# EAGLE design ATMEGA2560 Board_V2 (EAGLE 9.6.2)
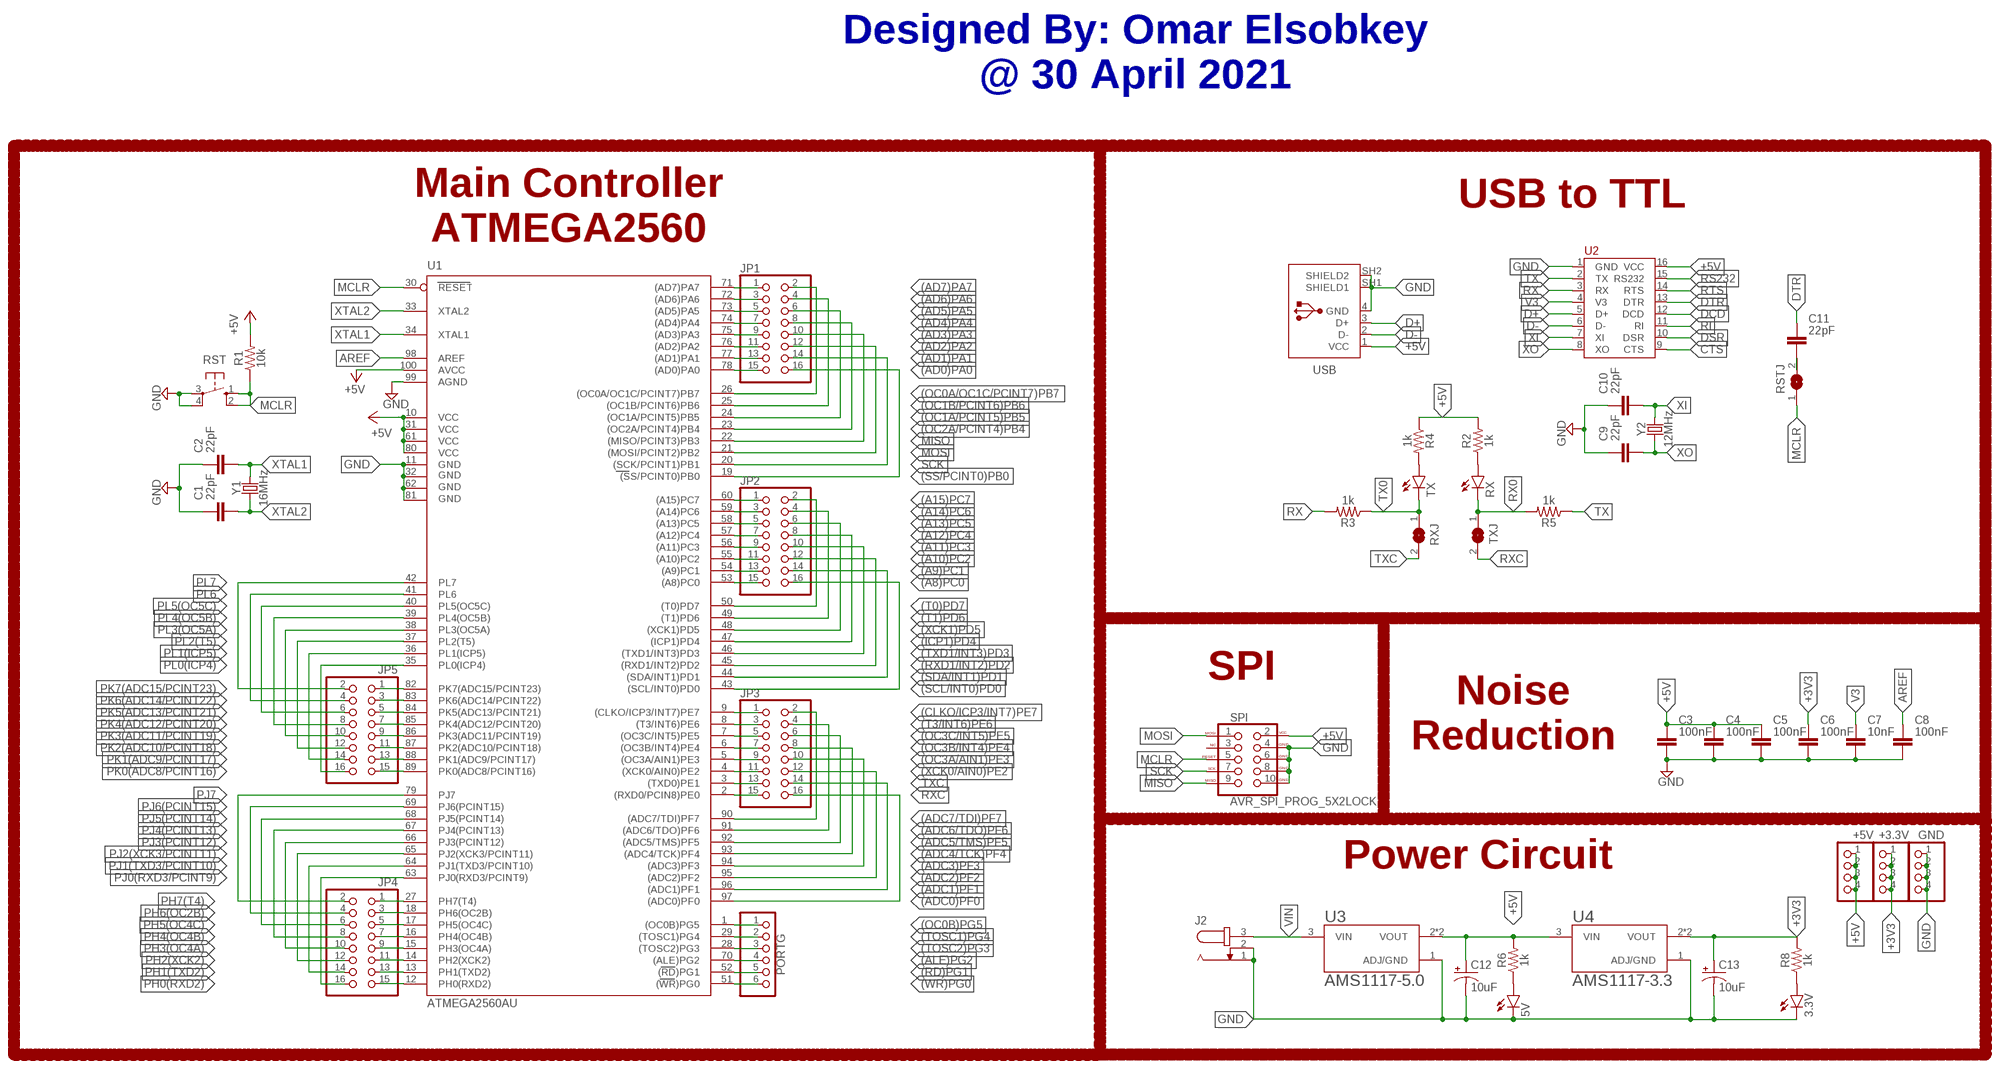
[diagram p0: schematic, sheet 1]

## Parts
3.3V  LEDCHIP-LED0805  [CHIP-LED0805]
5V  LEDCHIP-LED0805  [CHIP-LED0805]
+3.3V  PINHD-1X4  [1X04]
+5V  PINHD-1X4  [1X04]
C1  22pF  C_CHIP-0805(2012-METRIC)  [CAPC2012X110]
C2  22pF  C_CHIP-0805(2012-METRIC)  [CAPC2012X110]
C3  100nF  C_CHIP-0805(2012-METRIC)  [CAPC2012X110]
C4  100nF  C_CHIP-0805(2012-METRIC)  [CAPC2012X110]
C5  100nF  C_CHIP-0805(2012-METRIC)  [CAPC2012X110]
C6  100nF  C_CHIP-0805(2012-METRIC)  [CAPC2012X110]
C7  10nF  C_CHIP-0805(2012-METRIC)  [CAPC2012X110]
C8  100nF  C_CHIP-0805(2012-METRIC)  [CAPC2012X110]
C9  22pF  C_CHIP-0805(2012-METRIC)  [CAPC2012X110]
C10  22pF  C_CHIP-0805(2012-METRIC)  [CAPC2012X110]
C11  22pF  C_CHIP-0805(2012-METRIC)  [CAPC2012X110]
C12  10uF  10UF-POLAR-RADIAL-2.5MM-KIT-25V-20%  [CPOL-RADIAL-2.5MM-5MM-KIT]
C13  10uF  10UF-POLAR-RADIAL-2.5MM-KIT-25V-20%  [CPOL-RADIAL-2.5MM-5MM-KIT]
GND  PINHD-1X4  [1X04]
J2  JACK-PLUG0  [SPC4077]
JP1  PINHD-2X8  [2X08]
JP2  PINHD-2X8  [2X08]
JP3  PINHD-2X8  [2X08]
JP4  PINHD-2X8  [2X08]
JP5  PINHD-2X8  [2X08]
PORTG  PINHD-1X6  [1X06]
R1  10k  RESISTOR1206  [1206]
R2  1k  RESISTOR1206  [1206]
R3  1k  RESISTOR1206  [1206]
R4  1k  RESISTOR1206  [1206]
R5  1k  RESISTOR1206  [1206]
R6  1k  RESISTOR1206  [1206]
R8  1k  RESISTOR1206  [1206]
RST  10-XX  [B3F-10XX]
RSTJ  SJW  [SJW]
RX  LEDCHIP-LED0805  [CHIP-LED0805]
RXJ  SJW  [SJW]
SPI  AVR_SPI_PROG_5X2LOCK  [2X5-SHROUDED_LOCK]
TX  LEDCHIP-LED0805  [CHIP-LED0805]
TXJ  SJW  [SJW]
U1  ATMEGA2560AU  [TQFP100]
U2  CH340G  [SOP-16]
U3  AMS1117-5.0  [AMS1117-5.0]
U4  AMS1117-3.3  AMS1117-5.0  [AMS1117-5.0]
USB  61729-1011  [61729-1011BLF]
Y1  16MHz  CRYSTALPTH-HC49UV  [HC49U]
Y2  12MHz  CRYSTALPTH-HC49UV  [HC49U]

## Nets
(A8)PC0: JP2.15 U1.53((A8)PC0)
(A9)PC1: JP2.13 U1.54((A9)PC1)
(A10)PC2: JP2.11 U1.55((A10)PC2)
(A11)PC3: JP2.9 U1.56((A11)PC3)
(A12)PC4: JP2.7 U1.57((A12)PC4)
(A13)PC5: JP2.5 U1.58((A13)PC5)
(A14)PC6: JP2.3 U1.59((A14)PC6)
(A15)PC7: JP2.1 U1.60((A15)PC7)
(AD0)PA0: JP1.15 U1.78((AD0)PA0)
(AD1)PA1: JP1.13 U1.77((AD1)PA1)
(AD2)PA2: JP1.11 U1.76((AD2)PA2)
(AD3)PA3: JP1.9 U1.75((AD3)PA3)
(AD4)PA4: JP1.7 U1.74((AD4)PA4)
(AD5)PA5: JP1.5 U1.73((AD5)PA5)
(AD6)PA6: JP1.3 U1.72((AD6)PA6)
(AD7)PA7: JP1.1 U1.71((AD7)PA7)
(ADC0)PF0: JP3.16 U1.97((ADC0)PF0)
(ADC1)PF1: JP3.14 U1.96((ADC1)PF1)
(ADC2)PF2: JP3.12 U1.95((ADC2)PF2)
(ADC3)PF3: JP3.10 U1.94((ADC3)PF3)
(ADC4/TCK)PF4: JP3.8 U1.93((ADC4/TCK)PF4)
(ADC5/TMS)PF5: JP3.6 U1.92((ADC5/TMS)PF5)
(ADC6/TDO)PF6: JP3.4 U1.91((ADC6/TDO)PF6)
(ADC7/TDI)PF7: JP3.2 U1.90((ADC7/TDI)PF7)
(ALE)PG2: PORTG.4 U1.70((ALE)PG2)
(CLKO/ICP3/INT7)PE7: JP3.1 U1.9((CLKO/ICP3/INT7)PE7)
(ICP1)PD4: JP2.8 U1.47((ICP1)PD4)
(OC0A/OC1C/PCINT7)PB7: JP1.2 U1.26((OC0A/OC1C/PCINT7)PB7)
(OC0B)PG5: PORTG.1 U1.1((OC0B)PG5)
(OC1A/PCINT5)PB5: JP1.6 U1.24((OC1A/PCINT5)PB5)
(OC1B/PCINT6)PB6: JP1.4 U1.25((OC1B/PCINT6)PB6)
(OC2A/PCINT4)PB4: JP1.8 U1.23((OC2A/PCINT4)PB4)
(OC3A/AIN1)PE3: JP3.9 U1.5((OC3A/AIN1)PE3)
(OC3B/INT4)PE4: JP3.7 U1.6((OC3B/INT4)PE4)
(OC3C/INT5)PE5: JP3.5 U1.7((OC3C/INT5)PE5)
(RD)PG1: PORTG.5 U1.52((RD)PG1)
(RXD1/INT2)PD2: JP2.12 U1.45((RXD1/INT2)PD2)
(SCL/INT0)PD0: JP2.16 U1.43((SCL/INT0)PD0)
(SDA/INT1)PD1: JP2.14 U1.44((SDA/INT1)PD1)
(SS/PCINT0)PB0: JP1.16 U1.19((SS/PCINT0)PB0)
(T0)PD7: JP2.2 U1.50((T0)PD7)
(T1)PD6: JP2.4 U1.49((T1)PD6)
(T3/INT6)PE6: JP3.3 U1.8((T3/INT6)PE6)
(TOSC1)PG4: PORTG.2 U1.29((TOSC1)PG4)
(TOSC2)PG3: PORTG.3 U1.28((TOSC2)PG3)
(TXD1/INT3)PD3: JP2.10 U1.46((TXD1/INT3)PD3)
(WR)PG0: PORTG.6 U1.51((WR)PG0)
(XCK0/AIN0)PE2: JP3.11 U1.4((XCK0/AIN0)PE2)
(XCK1)PD5: JP2.6 U1.48((XCK1)PD5)
+3V3: +3.3V.1 +3.3V.2 +3.3V.3 +3.3V.4 C6.1 C13.1(+) R8.2 U4.2(VOUT) U4.4(VOUT)
+5V: +5V.1 +5V.2 +5V.3 +5V.4 C3.1 C4.1 C5.1 C12.1(+) R1.2 R2.2 R4.1 R6.2 SPI.2(VCC) U1.10(VCC) U1.31(VCC1) U1.61(VCC2) U1.80(VCC3) U1.100(AVCC) U2.16(VCC) U3.2(VOUT) U3.4(VOUT) U4.3(VIN) USB.1(VCC)
AREF: C8.1 U1.98(AREF)
CTS: U2.9(CTS)
D+: U2.5(D+) USB.3(D+)
D-: U2.6(D-) USB.2(D-)
DCD: U2.12(DCD)
DSR: U2.10(DSR)
DTR: C11.1 U2.13(DTR)
GND: 3.3V.C 5V.C C1.1 C2.1 C3.2 C4.2 C5.2 C6.2 C7.2 C8.2 C9.1 C10.1 C12.2(-) C13.2(-) GND.1 GND.2 GND.3 GND.4 J2.1 J2.2 RST.3(P) RST.4(P1) SPI.4(GND) SPI.6(GND) SPI.8(GND) SPI.10(GND) U1.11(GND) U1.32(GND1) U1.62(GND2) U1.81(GND3) U1.99(AGND) U2.1(GND) U3.1(ADJ/GND) U4.1(ADJ/GND) USB.4(GND) USB.SH1(SHIELD1) USB.SH2(SHIELD2)
MCLR: R1.1 RST.1(S) RST.2(S1) RSTJ.1 SPI.5(RESET) U1.30(RESET)
MISO: JP1.10 SPI.9(MISO) U1.22((MISO/PCINT3)PB3)
MOSI: JP1.12 SPI.1(MOSI) U1.21((MOSI/PCINT2)PB2)
N$1: R2.1 RX.A
N$2: R4.2 TX.A
N$3: 5V.A R6.1
N$6: 3.3V.A R8.1
N$100: C11.2 RSTJ.2
PH0(RXD2): JP4.15 U1.12(PH0(RXD2))
PH1(TXD2): JP4.13 U1.13(PH1(TXD2))
PH2(XCK2): JP4.11 U1.14(PH2(XCK2))
PH3(OC4A): JP4.9 U1.15(PH3(OC4A))
PH4(OC4B): JP4.7 U1.16(PH4(OC4B))
PH5(OC4C): JP4.5 U1.17(PH5(OC4C))
PH6(OC2B): JP4.3 U1.18(PH6(OC2B))
PH7(T4): JP4.1 U1.27(PH7(T4))
PJ0(RXD3/PCINT9): JP4.16 U1.63(PJ0(RXD3/PCINT9))
PJ1(TXD3/PCINT10): JP4.14 U1.64(PJ1(TXD3/PCINT10))
PJ2(XCK3/PCINT11): JP4.12 U1.65(PJ2(XCK3/PCINT11))
PJ3(PCINT12): JP4.10 U1.66(PJ3(PCINT12))
PJ4(PCINT13): JP4.8 U1.67(PJ4(PCINT13))
PJ5(PCINT14): JP4.6 U1.68(PJ5(PCINT14))
PJ6(PCINT15): JP4.4 U1.69(PJ6(PCINT15))
PJ7: JP4.2 U1.79(PJ7)
PK0(ADC8/PCINT16): JP5.15 U1.89(PK0(ADC8/PCINT16))
PK1(ADC9/PCINT17): JP5.13 U1.88(PK1(ADC9/PCINT17))
PK2(ADC10/PCINT18): JP5.11 U1.87(PK2(ADC10/PCINT18))
PK3(ADC11/PCINT19): JP5.9 U1.86(PK3(ADC11/PCINT19))
PK4(ADC12/PCINT20): JP5.7 U1.85(PK4(ADC12/PCINT20))
PK5(ADC13/PCINT21): JP5.5 U1.84(PK5(ADC13/PCINT21))
PK6(ADC14/PCINT22): JP5.3 U1.83(PK6(ADC14/PCINT22))
PK7(ADC15/PCINT23): JP5.1 U1.82(PK7(ADC15/PCINT23))
PL0(ICP4): JP5.16 U1.35(PL0(ICP4))
PL1(ICP5): JP5.14 U1.36(PL1(ICP5))
PL2(T5): JP5.12 U1.37(PL2(T5))
PL3(OC5A): JP5.10 U1.38(PL3(OC5A))
PL4(OC5B): JP5.8 U1.39(PL4(OC5B))
PL5(OC5C): JP5.6 U1.40(PL5(OC5C))
PL6: JP5.4 U1.41(PL6)
PL7: JP5.2 U1.42(PL7)
RI: U2.11(RI)
RS232: U2.15(RS232)
RTS: U2.14(RTS)
RX: R3.2 U2.3(RX)
RX0: R5.2 RX.C TXJ.1
RXC: JP3.15 TXJ.2 U1.2((RXD0/PCIN8)PE0)
SCK: JP1.14 SPI.7(SCK) U1.20((SCK/PCINT1)PB1)
TX: R5.1 U2.2(TX)
TX0: R3.1 RXJ.1 TX.C
TXC: JP3.13 RXJ.2 U1.3((TXD0)PE1)
V3: C7.1 U2.4(V3)
VIN: J2.3 U3.3(VIN)
XI: C10.2 U2.7(XI) Y2.2
XO: C9.2 U2.8(XO) Y2.1
XTAL1: C2.2 U1.34(XTAL1) Y1.2
XTAL2: C1.2 U1.33(XTAL2) Y1.1
Unconnected: SPI.3(NC)

## Notes on the sheet
- Designed By: Omar Elsobkey
  @ 30 April 2021
- USB to TTL
- Main Controller
  ATMEGA2560
- SPI
- Noise
  Reduction
- Power Circuit

## Library data of the parts
3.3V 5V RX TX = led:LED: LED OSRAM: - CHIPLED LG R971, LG N971, LY N971, LG Q971, LY Q971, LO R971, LY R971 LH N974, LH R974 LS Q976, LO Q976, LY Q976 LO Q996 - Hyper CHIPLED LW Q18S LB Q993, LB Q99A, LB R99A - SideLED LS A670, LO A670, LY A670, LG A670, LP A670 LB A673, LV A673, LT A673, LW A673 LH A674 LY A675 LS A676, LA A676, LO A676, LY A676, LW A676 LS A679, LY A679, LG A679 - Hyper Micro SIDELED® LS Y876, LA Y876, LO Y876, LY Y876 LT Y87S - SmartLED LW L88C, LW L88S LB L89C, LB L89S, LG L890 LS L89K, LO L89K, LY L89K LS L896, LA L896, LO L896, LY L896 - TOPLED LS T670, LO T670, LY T670, LG T670, LP T670 LSG T670, LSP T670, LSY T670, LOP T670, LYG T670 LG T671, LOG T671, LSG T671 LB T673, LV T673, LT T673, LW T673 LH T674 LS T676, LA T676, LO T676, LY T676, LB T676, LH T676, LSB T676, LW T676 LB T67C, LV T67C, LT T67C, LS T67K, LO T67K, LY T67K, LW E67C LS E67B, LA E67B, LO E67B, LY E67B, LB E67C, LV E67C, LT E67C LW T67C LS T679, LY T679, LG T679 LS T770, LO T770, LY T770, LG T770, LP T770 LB T773, LV T773, LT T773, LW T773 LH T774 LS E675, LA E675, LY E675, LS T675 LS T776, LA T776, LO T776, LY T776, LB T776 LHGB T686 LT T68C, LB T68C - Hyper Mini TOPLED® LB M676 - Mini TOPLED Santana® LG M470 LS M47K, LO M47K, LY M47K Source: http://www.osram.convergy.de LUXEON: - LUMILED® LXK2-PW12-R00, LXK2-PW12-S00, LXK2-PW14-U00, LXK2-PW14-V00 LXK2-PM12-R00, LXK2-PM12-S00, LXK2-PM14-U00 LXK2-PE12-Q00, LXK2-PE12-R00, LXK2-PE12-S00, LXK2-PE14-T00, LXK2-PE14-U00 LXK2-PB12-K00, LXK2-PB12-L00, LXK2-PB12-M00, LXK2-PB14-N00, LXK2-PB14-P00, LXK2-PB14-Q00 LXK2-PR12-L00, LXK2-PR12-M00, LXK2-PR14-Q00, LXK2-PR14-R00 LXK2-PD12-Q00, LXK2-PD12-R00, LXK2-PD12-S00 LXK2-PH12-R00, LXK2-PH12-S00 LXK2-PL12-P00, LXK2-PL12-Q00, LXK2-PL12-R00 Source: www.luxeon.com KINGBRIGHT: KA-3528ASYC Source: www.kingbright.com
+3.3V +5V GND = pinhead:PINHD-1X4: PIN HEADER
C1-C11 = Capacitor:C: Capacitor - Generic; CATEGORY: Capacitor
C12 C13 = SparkFun-Capacitors:10UF-POLAR: 10.0µF polarized capacitors A capacitor is a passive two-terminal electrical component used to store electrical energy temporarily in an electric field.
J2 = con-jack:JACK-PLUG: DC POWER JACK Power Jack, DC, Right Angle, Through Hole, Rated 5A at 16VDC, PC Terminals Distributor: Farnell (www.Farnell.de) Drawing: 84N1161.pdf / 84N1162.pdf Manufacturer: SPC Technology (www.spctechnology.com) Type: SPC4077 / SPC 4078; OC_FARNELL: unknown; OC_NEWARK: unknown
JP1-JP5 = pinhead:PINHD-2X8: PIN HEADER
PORTG = pinhead:PINHD-1X6: PIN HEADER
R1-R6 R8 = SparkFun-Resistors:RESISTOR: Generic Resistor Package
RST = switch-omron:10-XX: OMRON SWITCH; MPN: B3F-1000; OC_FARNELL: 176432; OC_NEWARK: 36M3542
RSTJ RXJ TXJ = jumper:SJ: SMD solder JUMPER
SPI = SparkFun-Connectors:AVR_SPI_PROG_5X2: AVR 10-pin ICSP Header This is the standard AVR In Circuit Serial Programming header. Minimal, but includes pin one indicator. Works with standard Olimex programmers. SparkFun Products: 2x5 AVR ICSP Male Header <https://www.sparkfun.com/products/778> - PTH 2x5 Pin Shrouded Header <https://www.sparkfun.com/products/8506> - PTH2; PROD_ID: CONN-08671; SF_ID: PRT-08506
U1 = SparkFun-IC-Microcontroller:ATMEGA2560: Atmel 100-pin 8-bit uC 64/128/256 Kbytes FLASH 4 Kbytes EEPROM 8 Kbytes SRAM 86 General Purpose I/O pins 12-channels16-bit PWM 4 x Serial USARTs 16-channels 10-bit A/D SparkFun Products None.; PROD_ID: IC-10040
U2 = CH340G:CH340G
U3 U4 = AMS1117-5.0:AMS1117-5.0: Sot223/Pkg 1-Amp 5-Volt Low Drop Out Voltage Regulatator; AVAILABILITY: Unavailable; DESCRIPTION: Sot223/Pkg 1-Amp 5-Volt Low Drop Out Voltage Regulatator; MF: Advanced Monolithic Systems; MP: AMS1117-5.0; PACKAGE: None; PRICE: None
USB = Connector_USB:61729-1011: USB(2.0) Type-B, RCPT, 4POS, THT-R/A Datasheet <https://www.amphenol-icc.com/media/wysiwyg/files/drawing/61729.pdf>; CATEGORY: Connector; CONTACTS: 4; CURRENT_RATING: 1A; DESCRIPTION: CONN RCPT USB2.0 TYPEB 4POS R/A; GENDER: Receptacle; MANUFACTURER: Amphenol ICC (FCI); MOUNT_TYPE: R/A; MPN: 61729-1011BLF; OPERATING_TEMP: -55°C to 85°C; PART_STATUS: Active; ROHS_COMPLIANT: RoHS Compliant; SERIES: 61729; SUB-CATEGORY: USB; TYPE: USB-B
Y1 Y2 = SparkFun-Clocks:CRYSTAL: Crystals (Generic) These are passive quartz crystals, which can be used as a clock source for a microcontroller. Crystal's are two-terminal devices. They require external "load" capacitors to generate an oscillating signal.

## Board
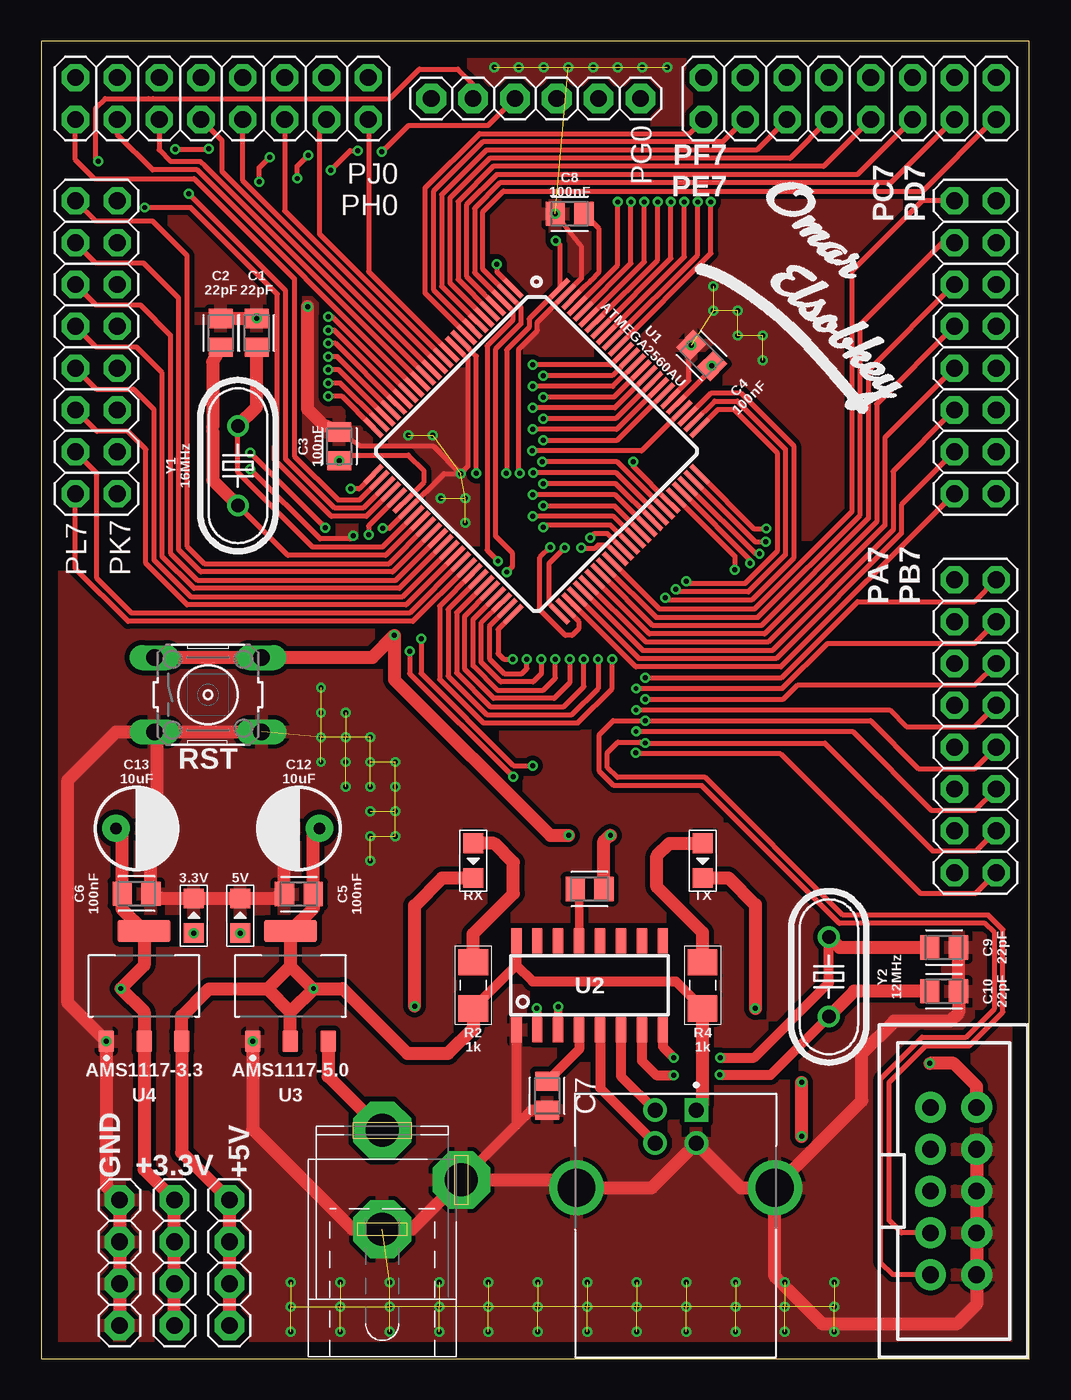
[diagram p1: board, top side]
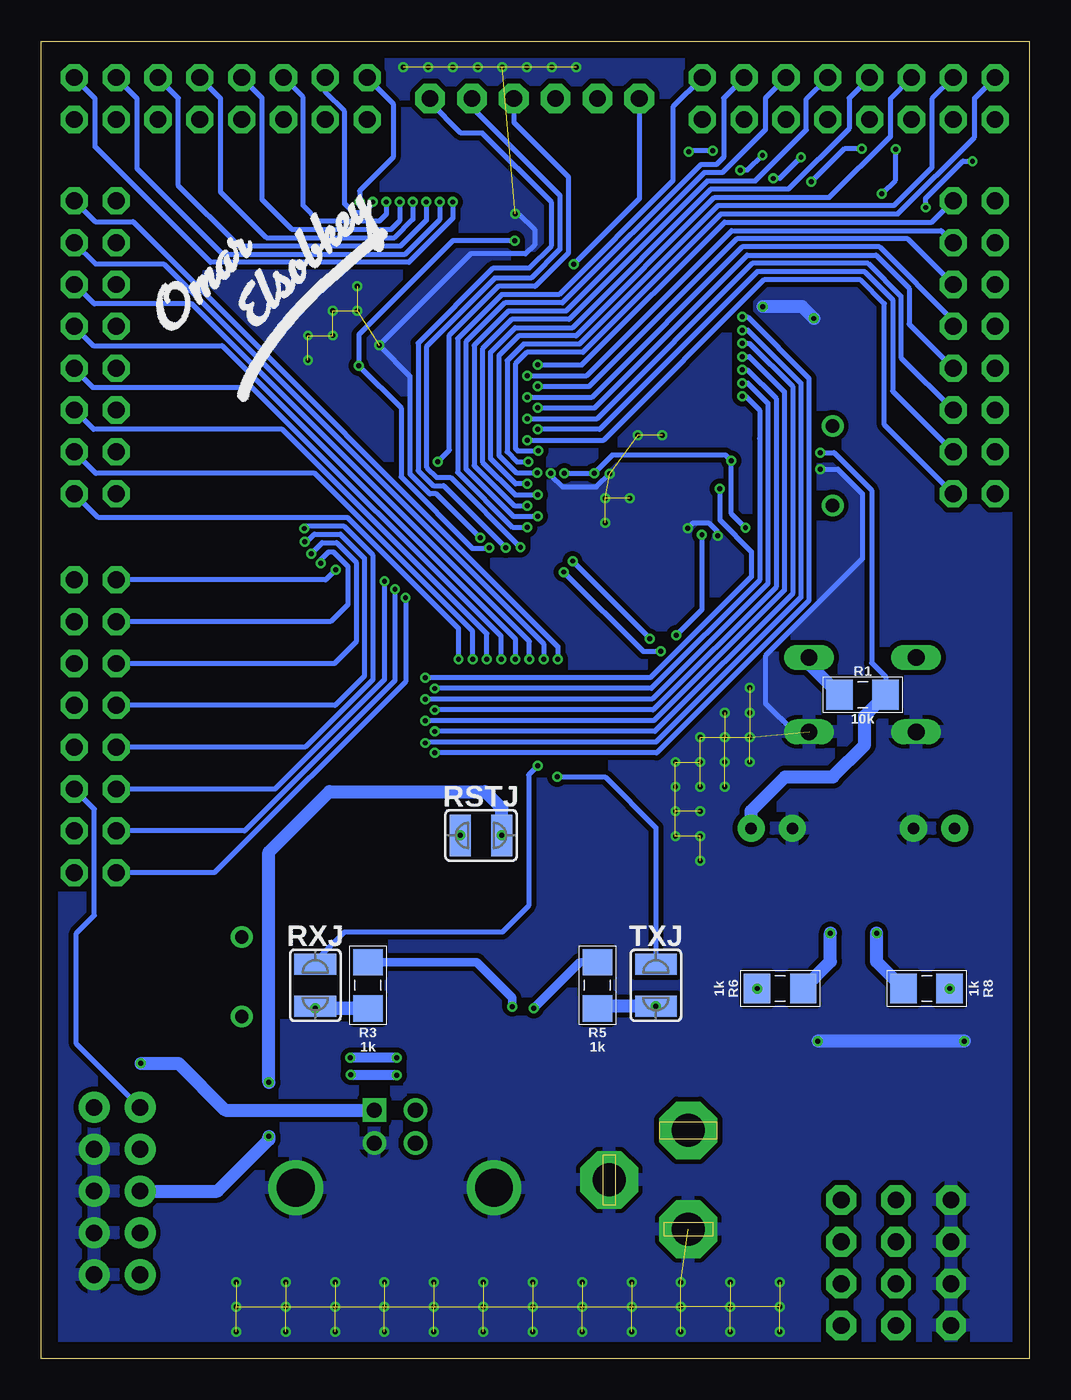
[diagram p2: board, bottom side, seen from below]

Size 60 x 80 mm. Coordinates in mm from the lower left corner, seen from the top.
Outline: 0,0 60,0 60,80 0,80 0,0
Copper layers (1*16): Top 0.035mm / dielectric 1.5mm / Bottom 0.035mm
Design rules "default *": minimum track width 0.3mm, minimum drill 0.2mm, track to track 0.2mm, track to pad 0.2mm, pad to pad 0.2mm, via to via 0.2mm, smd to smd 0.2mm, copper to edge 40mil, drill to drill 6mil, minimum pad ring 10mil, minimum via ring 6mil, stop-mask expansion 4mil, vias tented up to drill 0mil, thermal gap 10mil

### Footprints (pad centres in the part's own frame; a part is rotated, then mirrored left to right if it is on the bottom)
CHIP-LED0805 = smd 1.2 x 1.2: A 0,-1.05; C 0,1.05
1X04 = drill 1.016 pad 1.8 octagon: 1 -3.81,0; 2 -1.27,0; 3 1.27,0; 4 3.81,0
CAPC2012X110 = smd 1.165 x 1.465: 1 -0.875,0; 2 0.875,0
CPOL-RADIAL-2.5MM-5MM-KIT = drill 0.7 pad 1.651: 1 1.25,0; 2 -1.25,0
SPC4077 = drill 2 pad 3.5 octagon: 1 -3,0; 2 0,-4.8; 3 3,0
2X08 = drill 1.016 pad 1.65 octagon: 1 -8.89,-1.27; 2 -8.89,1.27; 3 -6.35,-1.27; 4 -6.35,1.27; 5 -3.81,-1.27; 6 -3.81,1.27; 7 -1.27,-1.27; 8 -1.27,1.27; 9 1.27,-1.27; 10 1.27,1.27; 11 3.81,-1.27; 12 3.81,1.27; 13 6.35,-1.27; 14 6.35,1.27; 15 8.89,-1.27; 16 8.89,1.27
1X06 = drill 1.016 pad 1.8 octagon: 1 -6.35,0; 2 -3.81,0; 3 -1.27,0; 4 1.27,0; 5 3.81,0; 6 6.35,0
1206 = smd 1.6 x 1.8: 1 -1.4,0; 2 1.4,0
B3F-10XX = drill 1.016 long: 1 -3.251,2.261; 2 3.251,2.261; 3 -3.251,-2.261; 4 3.251,-2.261
SJW = smd 1.27 x 2.54: 1 -1.27,0; 2 1.27,0
2X5-SHROUDED_LOCK = drill 1.016 pad 1.88: 1 -1.397,5.08; 2 1.397,5.08; 3 -1.397,2.54; 4 1.397,2.54; 5 -1.397,0; 6 1.397,0; 7 -1.397,-2.54; 8 1.397,-2.54; 9 -1.397,-5.08; 10 1.397,-5.08
TQFP100 = smd 1.5 x 0.3: 1 -8,6; 2 -8,5.5; 3 -8,5; 4 -8,4.5; 5 -8,4; 6 -8,3.5; 7 -8,3; 8 -8,2.5; 9 -8,2; 10 -8,1.5; 11 -8,1; 12 -8,0.5; 13 -8,0; 14 -8,-0.5; 15 -8,-1; 16 -8,-1.5; 17 -8,-2; 18 -8,-2.5; 19 -8,-3; 20 -8,-3.5; 21 -8,-4; 22 -8,-4.5; 23 -8,-5; 24 -8,-5.5; 25 -8,-6; 51 8,-6; 52 8,-5.5; 53 8,-5; 54 8,-4.5; 55 8,-4; 56 8,-3.5; 57 8,-3; 58 8,-2.5; 59 8,-2; 60 8,-1.5; 61 8,-1; 62 8,-0.5; 63 8,0; 64 8,0.5; 65 8,1; 66 8,1.5; 67 8,2; 68 8,2.5; 69 8,3; 70 8,3.5; 71 8,4; 72 8,4.5; 73 8,5; 74 8,5.5; 75 8,6 | smd 0.3 x 1.5: 26 -6,-8; 27 -5.5,-8; 28 -5,-8; 29 -4.5,-8; 30 -4,-8; 31 -3.5,-8; 32 -3,-8; 33 -2.5,-8; 34 -2,-8; 35 -1.5,-8; 36 -1,-8; 37 -0.5,-8; 38 0,-8; 39 0.5,-8; 40 1,-8; 41 1.5,-8; 42 2,-8; 43 2.5,-8; 44 3,-8; 45 3.5,-8; 46 4,-8; 47 4.5,-8; 48 5,-8; 49 5.5,-8; 50 6,-8; 76 6,8; 77 5.5,8; 78 5,8; 79 4.5,8; 80 4,8; 81 3.5,8; 82 3,8; 83 2.5,8; 84 2,8; 85 1.5,8; 86 1,8; 87 0.5,8; 88 0,8; 89 -0.5,8; 90 -1,8; 91 -1.5,8; 92 -2,8; 93 -2.5,8; 94 -3,8; 95 -3.5,8; 96 -4,8; 97 -4.5,8; 98 -5,8; 99 -5.5,8; 100 -6,8
SOP-16 = smd 0.635 x 1.524: 1 -4.445,-2.695; 2 -3.175,-2.695; 3 -1.905,-2.695; 4 -0.635,-2.695; 5 0.635,-2.695; 6 1.905,-2.695; 7 3.175,-2.695; 8 4.445,-2.695; 9 4.445,2.695; 10 3.175,2.695; 11 1.905,2.695; 12 0.635,2.695; 13 -0.635,2.695; 14 -1.905,2.695; 15 -3.175,2.695; 16 -4.445,2.695
AMS1117-5.0 = smd 0.93 x 1.31: 1 -2.29,-3.345; 2 0,-3.345; 3 2.29,-3.345 | smd 3.24 x 1.31: 4 0,3.345
61729-1011BLF = drill 0.92 square: 1 1.25,4.71 | drill 0.92: 2 -1.25,4.71; 3 -1.25,2.71; 4 1.25,2.71 | drill 2.3: SH1 -6.02,0; SH2 6.02,0
HC49U = drill 0.813: 1 -2.413,0; 2 2.413,0

### Placement (x,y rotation side)
3.3V  9.27,26.9 0 top
5V  12.09,26.9 0 top
+3.3V  8.09,5.83 270 top
+5V  11.43,5.83 270 top
C1  13.09,62.29 270 top
C2  10.91,62.29 270 top
C3  18.1,55.4 90 top
C4  40.1,60.92 135 top
C5  15.65,28.22 180 top
C6  5.79,28.24 0 top
C7  30.73,15.97 270 top
C8  32.09,69.52 180 top
C9  54.82,24.97 180 top
C10  54.82,22.32 180 top
C11  33.29,28.52 0 top
C12  15.65,32.21 0 top
C13  5.79,32.21 180 top
GND  4.76,5.83 270 top
J2  20.71,10.87 90 top
JP1  56.72,38.4 270 top
JP2  56.72,61.42 270 top
JP3  49.1,76.52 0 top
JP4  10.97,76.52 0 top
JP5  3.35,61.42 90 top
PORTG  30.04,76.52 0 top
R1  10.13,40.32 0 bottom
R2  26.23,22.68 270 top
R3  40.16,22.68 90 bottom
R4  40.16,22.68 90 top
R5  26.23,22.68 270 bottom
R6  15.13,22.48 180 bottom
R8  6.24,22.48 0 bottom
RST  10.13,40.32 0 top
RSTJ  33.29,31.77 180 bottom
RX  26.23,30.25 180 top
RXJ  43.35,22.68 90 bottom
SPI  55.39,10.19 0 top
TX  40.16,30.25 180 top
TXJ  22.68,22.68 90 bottom
U1  30.08,55.11 315 top
U2  33.29,22.68 0 top
U3  15.13,22.63 0 top
U4  6.24,22.63 0 top
U$1  [OMAR_ELSOBKEY_X1]  47.08,64.85 315 top
U$2  [OMAR_ELSOBKEY_X1]  46.43,65.5 45 bottom
USB  38.52,10.38 0 top
Y1  11.95,54.22 270 top
Y2  47.82,23.2 270 top

### Tracks (layer width: path | path; a pad name or v marks a point on that pad's centre or on a via)
(A8)PC0
  Top 0.3: JP2.15 55.42,52.53 44.91,42.02 36.1,42.02 32.48,45.64 | 32.48,45.64 32.34,45.77 | U1.53 32.48,45.64 | 32.48,45.64
(A9)PC1
  Top 0.3: U1.54 36.31,42.52 44.62,42.52 52.23,50.12 52.23,51.84 JP2.13
(A10)PC2
  Top 0.3: U1.55 36.51,43.02 44.41,43.02 51.73,50.33 51.73,53.88 JP2.11
(A11)PC3
  Top 0.3: 32.84,47.4 36.72,43.52 44.13,43.52 51.23,50.61 51.23,55.92 JP2.9 | 32.84,47.4 | 32.84,47.4 U1.56
(A12)PC4
  Top 0.3: JP2.7 50.73,57.96 50.73,50.81 43.93,44.02 36.93,44.02 33.47,47.48 | 33.47,47.48 | 33.47,47.48 33.34,47.61 | 33.34,47.61 | 33.34,47.61 U1.57
(A13)PC5
  Top 0.3: JP2.5 50.23,60 50.23,51.02 43.72,44.52 37.14,44.52 U1.58
(A14)PC6
  Top 0.3: U1.59 37.34,45.02 43.51,45.02 49.73,51.23 49.73,62.79 54.7,67.77 JP2.3
(A15)PC7
  Top 0.3: JP2.1 53.49,70.31 49.23,66.04 49.23,51.44 43.31,45.52 37.55,45.52 U1.60
(AD0)PA0  (via drill 0.3)
  Top 0.3: U1.78 40.68,58.65 42.47,58.65 45.68,55.44 45.68,48.61 43.14,46.07 38.03,46.07 v37.88,46.22
  Bottom 0.3: JP1.15 49.48,29.52 37.88,41.11 v37.88,46.22
(AD1)PA1  (via drill 0.3)
  Top 0.3: U1.77 40.89,58.15 42.26,58.15 45.18,55.23 45.18,48.81 42.93,46.57 38.67,46.57 v38.52,46.72
  Bottom 0.3: JP1.13 47.65,32.05 38.53,41.17 38.53,46.49 38.52,46.5 v38.52,46.72
(AD2)PA2  (via drill 0.3)
  Top 0.3: U1.76 41.1,57.65 42.05,57.65 44.68,55.02 44.68,49.02 42.72,47.07 39.31,47.07 v39.16,47.22
  Bottom 0.3: v39.16,47.22 39.16,47 39.17,46.99 39.17,41.24 45.81,34.59 JP1.11
(AD3)PA3  (via drill 0.3)
  Top 0.3: U1.75 43.26,50.41 v44.02,50.41
  Bottom 0.3: JP1.9 43.98,37.13 39.88,41.24 | 39.86,41.26 39.88,41.24 | v44.02,50.41 43.86,50.57 41.63,50.57 39.88,48.81 39.88,41.24
(AD4)PA4  (via drill 0.3)
  Top 0.3: U1.74 43.37,49.6 v44,49.6
  Bottom 0.3: JP1.7 42.15,39.67 40.38,41.44 40.38,48.61 41.84,50.07 43.41,50.07 43.87,49.6 v44,49.6
(AD5)PA5  (via drill 0.3)
  Top 0.3: U1.73 43.37,48.89 v43.61,48.89
  Bottom 0.3: v43.61,48.89 42.94,49.56 42.06,49.56 40.88,48.37 40.88,43.54 42.2,42.22 JP1.5
(AD6)PA6  (via drill 0.3)
  Top 0.3: U1.72 43.03,48.52 v43.03,48.3
  Bottom 0.3: v43.03,48.3 43.03,48.51 42.55,49 42.26,49 41.38,48.12 41.38,45.8 42.42,44.76 JP1.3
(AD7)PA7  (via drill 0.3)
  Top 0.3: U1.71 42.11,48.73 v42.11,47.9
  Bottom 0.3: v42.11,47.9 42.72,47.3 JP1.1
(ADC0)PF0  (via drill 0.3)
  Top 0.3: U1.97 35,66.4 v35,70.24
  Bottom 0.3: JP3.16 56.72,76.52 56.72,73.58 49.71,66.57 37.68,66.57 35,69.25 v35,70.24
(ADC1)PF1  (via drill 0.3)
  Top 0.3: U1.96 35.81,66.5 v35.81,70.24
  Bottom 0.3: JP3.14 54.18,76.52 54.18,72.26 48.99,67.07 37.89,67.07 35.81,69.15 v35.81,70.24
(ADC2)PF2  (via drill 0.3)
  Top 0.3: U1.95 36.62,66.61 v36.62,70.24
  Bottom 0.3: JP3.12 51.66,76.54 51.66,71.22 48.02,67.57 38.17,67.57 36.62,69.13 v36.62,70.24
(ADC3)PF3  (via drill 0.3)
  Top 0.3: U1.94 37.43,66.71 v37.43,70.24
  Bottom 0.3: JP3.10 49.1,76.52 49.1,70.84 46.33,68.07 38.54,68.07 37.43,69.18 v37.43,70.24
(ADC4/TCK)PF4  (via drill 0.3)
  Top 0.3: U1.93 38.24,66.81 v38.24,70.24
  Bottom 0.3: JP3.8 46.58,76.54 46.58,70.38 44.77,68.57 38.75,68.57 38.24,69.08 v38.24,70.24
(ADC5/TMS)PF5  (via drill 0.3)
  Top 0.3: U1.92 39.05,66.91 v39.05,70.24
  Bottom 0.3: JP3.6 44.09,76.59 44.09,70.03 43.14,69.07 39.47,69.07 39.05,69.49 v39.05,70.24
(ADC6/TDO)PF6  (via drill 0.3)
  Top 0.3: U1.91 39.86,67.01 v39.86,70.24
  Bottom 0.3: JP3.4 42.75,76.91 41.57,75.73 41.57,70.12 41.02,69.57 40.41,69.57 39.86,70.12 v39.86,70.23 v39.86,70.24
(ADC7/TDI)PF7  (via drill 0.3)
  Top 0.3: U1.90 40.66,67.11 v40.66,70.24
  Bottom 0.3: JP3.2 38.63,76.21 38.63,72.95 40.66,70.92 v40.66,70.24
(ALE)PG2  (via drill 0.3)
  Top 0.3: U1.70 35.94,54.2 v35.94,54.45
  Bottom 0.3: v35.94,54.45 35.22,55.17 35.22,62.15 32.63,64.74 32.26,65.11 30.01,65.11 27.99,67.13 27.99,71.75 31.3,75.07 PORTG.4
(CLKO/ICP3/INT7)PE7
  Top 0.3: JP3.1 39.35,74.39 26.61,74.39 23.31,71.09 23.31,64.7 U1.9 26.27,61.75 | 26.27,61.75
(ICP1)PD4  (via drill 0.3)
  Top 0.3: U1.47 26.22,44.89 26.22,42.06 27.68,40.6 30.5,40.6 31.22,41.33 v31.22,42.48
  Bottom 0.3: JP2.8 57.99,62.65 56.85,61.51 49.01,61.51 31.22,43.71 v31.22,42.48
(OC0A/OC1C/PCINT7)PB7  (via drill 0.3)
  Top 0.3: U1.26 19.3,52.82 v18.8,52.82 | v36.68,41.35 44.95,41.35 49.58,45.97 56.67,45.97 JP1.2
  Bottom 0.3: v36.68,41.35 23.01,41.35 16.88,47.48 16.88,49.02 18.8,50.93 v18.8,52.82
(OC0B)PG5  (via drill 0.3)
  Top 0.3: v27.67,66.46 27.67,66 U1.1
  Bottom 0.3: PORTG.1 23.69,70.44 v27.67,66.46
(OC1A/PCINT5)PB5  (via drill 0.3)
  Top 0.3: U1.24 18.17,59.24 v17.44,59.24 | v36.68,40.05 45.06,40.05 45.94,40.92 56.69,40.92 JP1.6
  Bottom 0.3: v17.44,59.24 17.1,59.24 15.88,58.02 15.88,47.07 22.9,40.05 v36.68,40.05
(OC1B/PCINT6)PB6  (via drill 0.3)
  Top 0.3: U1.25 18.27,58.43 v17.44,58.43 | v36.12,40.7 45.01,40.7 47.74,43.43 56.67,43.43 JP1.4
  Bottom 0.3: v17.44,58.43 17.23,58.43 16.38,57.58 16.38,55.88 16.38,47.27 22.96,40.7 v36.12,40.7
(OC2A/PCINT4)PB4  (via drill 0.3)
  Top 0.3: U1.23 18.07,60.04 v17.44,60.04 | v36.12,39.39 51.51,39.39 52.53,38.38 56.69,38.38 JP1.8
  Bottom 0.3: v17.44,60.04 17.12,60.04 15.38,58.31 15.38,46.86 22.85,39.39 v36.12,39.39
(OC3A/AIN1)PE3
  Top 0.3: JP3.9 47.51,72.39 27.44,72.39 25.31,70.26 25.31,65.53 U1.5
(OC3B/INT4)PE4
  Top 0.3: JP3.7 45.47,72.89 27.23,72.89 24.81,70.47 24.81,65.32 U1.6
(OC3C/INT5)PE5
  Top 0.3: JP3.5 43.43,73.39 27.03,73.39 24.31,70.68 24.31,65.12 U1.7
(RD)PG1  (via drill 0.3)
  Top 0.3: U1.52 | U1.52 32.63,44.78 32.63,44.31 32.23,43.92 31.83,43.92 30.28,45.47 30.28,48.66 v30.9,49.28
  Bottom 0.3: v30.9,49.28 35.14,53.52 35.99,53.52 36.59,54.11 36.59,61.49 32.73,65.35 32.46,65.61 30.25,65.61 28.5,67.36 28.5,70.64 33.85,75.98 PORTG.5
(RXD1/INT2)PD2  (via drill 0.3)
  Top 0.3: U1.45 25.22,45.3 25.22,41.65 27.26,39.6 31.73,39.6 32.94,40.82 v32.94,42.48
  Bottom 0.3: JP2.12 56.81,56.43 45.35,56.43 32.94,44.03 v32.94,42.48
(SCL/INT0)PD0  (via drill 0.3)
  Top 0.3: U1.43 24.2,45.7 24.2,41.26 26.85,38.6 32.58,38.6 34.66,40.69 v34.66,42.48
  Bottom 0.3: JP2.16 56.53,51.07 41.4,51.07 34.66,44.33 v34.66,42.48
(SDA/INT1)PD1  (via drill 0.3)
  Top 0.3: U1.44 24.71,45.51 24.71,41.45 27.06,39.1 32.22,39.1 33.81,40.69 v33.81,42.48
  Bottom 0.3: JP2.14 56.67,53.75 43.38,53.75 33.81,44.18 v33.81,42.48
(SS/PCINT0)PB0  (via drill 0.3)
  Top 0.3: U1.19 17.68,63.26 v17.44,63.26 | JP1.16 56.74,28.27 53.37,28.27 44.9,36.74 36.14,36.74 v36.09,36.78
  Bottom 0.3: v17.44,63.26 17.11,63.26 13.38,59.53 13.38,46.03 22.63,36.78 v36.09,36.78
(T0)PD7  (via drill 0.3)
  Top 0.3: U1.50 27.74,44.29 27.74,42.81 28.07,42.48 v28.63,42.48
  Bottom 0.3: v28.63,42.48 28.63,43.24 54.42,69.04 56.72,69.04 JP2.2
(T1)PD6  (via drill 0.3)
  Top 0.3: U1.49 27.22,44.48 27.22,42.51 28.12,41.6 29.18,41.6 29.49,41.91 v29.49,42.48
  Bottom 0.3: JP2.4 56.69,66.47 52.56,66.47 35.21,49.12 29.49,43.4 v29.49,42.48
(T3/INT6)PE6
  Top 0.3: JP3.3 41.39,73.89 26.82,73.89 23.81,70.89 23.81,64.91 U1.8
(TOSC1)PG4  (via drill 0.3)
  Top 0.3: U1.29 19.75,51.15 17.62,51.15 14.34,54.42 | 14.34,54.42 14.14,54.63 14.14,55.37 | v6.3,69.9 9.09,69.9 14.34,64.64 14.34,54.42 | v3.45,72.72 3.33,72.85 3.33,75.95 3.89,76.5 6.53,76.5 6.78,76.5 21.16,76.5 22.96,78.31 25.3,78.31 26.23,77.38 PORTG.2
  Bottom 0.3: v6.3,69.9 6.3,70.46 4.04,72.72 v3.45,72.72
(TOSC2)PG3  (via drill 0.3)
  Top 0.3: U1.28 19.54,51.65 17.83,51.65 14.84,54.63 14.84,64.85 v8.96,70.73 | v8.13,73.43 10.16,73.43 v10.19,73.46 | v13.24,71.46 13.24,72.32 v13.87,72.95 | v15.54,71.66 15.54,72.42 v16.2,73.08 | v17.57,72.16 18.76,73.36 v19.22,73.36 | v20.68,73.28 20.7,73.28 22.31,74.89 27.14,74.89 PORTG.3
  Bottom 0.3: v8.96,70.73 8.13,71.56 v8.13,73.43 | v10.19,73.46 11.24,73.46 v13.24,71.46 | v13.87,72.95 15.15,71.66 v15.54,71.66 | v16.2,73.08 17.12,72.16 v17.57,72.16 | v19.22,73.36 20.6,73.36 v20.68,73.28
(TXD1/INT3)PD3  (via drill 0.3)
  Top 0.3: U1.46 25.72,45.1 25.72,41.86 27.47,40.1 31.14,40.1 32.08,41.05 v32.08,42.48
  Bottom 0.3: JP2.10 57.99,60.11 56.85,58.97 47.18,58.97 32.08,43.87 v32.08,42.48
(WR)PG0  (via drill 0.3)
  Top 0.3: U1.51 30.84,45.87 30.84,48.29 v31.8,49.25
  Bottom 0.3: PORTG.6 36.39,76.29 34.52,74.42 33.22,74.42 29,70.21 29,67.59 30.36,66.24 32.55,66.24 37.11,61.67 37.11,53.93 36.2,53.02 35.56,53.02 v31.8,49.25
(XCK0/AIN0)PE2
  Top 0.3: JP3.11 49.55,71.89 27.65,71.89 25.81,70.06 25.81,65.74 26.88,64.67 27.41,64.14 U1.4
(XCK1)PD5  (via drill 0.3)
  Top 0.3: U1.48 26.72,44.68 26.72,42.3 27.91,41.1 29.87,41.1 30.35,41.58 v30.35,42.48
  Bottom 0.3: JP2.6 57.95,65.23 56.77,64.05 50.85,64.05 30.35,43.56 v30.35,42.48
+3V3  (via drill 0.3)
  Top 0.8: +3.3V.4 +3.3V.3 +3.3V.2 +3.3V.1 6.24,11.49 U4.2 6.24,21.08 R8.2 6.24,23.88 U4.4 4.92,27.3 C6.1 4.92,31.79 4.52,32.19 C13.1
  other vias: 4.84,22.48
+5V  (via drill 0.3)
  Top 0.3: C3.1 18.84,54.87 22.3,54.87 23.22,53.95 23.22,53.2 U1.31 | v17.24,50.45 17.22,50.47 17.22,50.48 12.76,54.94 12.76,54.97 v12.71,55.02 | U1.61 34.37,49.4 33.81,49.4 33.6,49.19 33.06,49.19 33,49.25 v32.78,49.25 | U1.80 40.64,60.02 C4.1 | U1.100 31.49,67.64 v31.24,67.89 | U1.100 | U1.100 29.63,63.15 29.63,62.63 28.25,61.26 28.25,53.8 v28.23,53.77 | v26.42,53.77 26.42,60.88 U1.10 | U1.10
  Top 0.508: 28.84,23.89 29.82,22.91 36.17,22.91
  Top 0.6: U2.16 28.85,23.9 | 28.85,23.9 28.84,23.89 R2.2 | 28.85,23.9 29.84,22.91 36.17,22.91 38.53,22.91 R4.1
  Top 0.8: +5V.4 +5V.3 +5V.2 +5V.1 8.53,12.54 U4.3 8.53,20.8 10.19,22.45 13.74,22.45 | USB.1 40.16,15.48 R4.1 | SPI.2 56.79,16.54 55.4,17.93 v53.95,17.93 | U3.2 15.13,21.06 | 15.13,23.85 U3.4 16.52,27.36 C5.1 16.52,31.83 C12.1 | 13.74,22.45 15.13,23.85 | 13.74,22.45 15.13,21.06 | 15.13,23.85 16.5,22.48 R6.2 | R6.2 15.13,21.08 15.13,21.06 | R2.2 26.23,20.08 24.69,18.54 22.24,18.54 18.3,22.48 R6.2
  Bottom 0.3: v17.24,50.45 18.1,51.32 C3.1 18.44,54.86 25.33,54.86 v26.42,53.77 v28.23,53.77 | v12.71,55.02 11.86,55.02 9.58,52.73 9.58,42.26 8.73,41.41 R1.2 | v32.78,49.25 33,49.25 33.06,49.19 33.8,49.19 38.15,53.54 38.15,57.73 C4.1 40.72,62.18 35.01,67.89 v31.24,67.89
  Bottom 0.8: v53.95,17.93 51.65,17.93 48.82,15.09 USB.1 | C12.1 16.9,33.27 14.83,35.33 11.94,35.33 10.01,37.26 10.01,39.04 R1.2
  other vias: 16.53,22.48 18.1,54.52 40.72,60.3
AREF
  Top 0.3: 32.92,65.03 U1.98 33.05,65.15 33.36,65.46 33.85,65.96 33.85,68.63 C8.1
D+
  Top 0.6: USB.3 33.93,16.44 U2.5
D-
  Top 0.6: U2.6 35.2,17.17 USB.2
DTR
  Top 0.508: C11.1 32.66,27.89 U2.13
GND  (via drill 0.3)  (73 unrouted)
  Top 0.3: C3.2 19.35,55.42 23.8,55.42 v25.48,53.75 | v20.74,50.43 21.15,50.43 U1.32 24.47,53.75 v25.48,53.75 | v18.93,49.98 18.74,49.78 16.94,49.78 v12.71,54.02 | U1.62 34.38,50.1 33.59,50.1 v33.33,49.84 | U1.81 39.32,59.41 39.32,61.69 C4.2 | C8.2 32.79,67.55 32.79,65.61 U1.99 31.7,64.51 | v25.48,53.75 25.91,54.18 25.91,60.69 U1.11 | v29.06,53.77 29.01,53.77 29.01,61.3 30.13,62.42 30.13,62.94 31.7,64.51 | 31.7,64.51 32.48,65.29 | 31.7,64.51
  Top 0.6: U2.1 28.85,14.21 | 28.85,14.21 J2.2 | C7.2 29.74,15.1 28.85,14.21
  Top 0.8: GND.4 GND.3 GND.2 GND.1 3.95,10.45 U4.1 1.63,21.61 1.63,35.13 4.55,38.06 RST.3 | USB.SH2 42.48,10.38 USB.4 37.06,10.38 USB.SH1 32.02,10.87 J2.2 22.51,7.87 J2.1 18.9,7.87 12.84,13.93 U3.1 | SPI.4 SPI.6 SPI.8 SPI.10 56.79,3.32 55.58,2.11 47.45,2.11 44.54,5.01 USB.SH2 | C12.2 14.38,32.19 14.77,31.79 C5.2 14.11,27.95 5V.C 3.3V.C 7.36,27.95 C6.2 6.67,31.83 C13.2 7.04,37.89 RST.3 | USB.SH2 49.84,15.68 49.84,18.54 51.79,20.5 55.17,20.5 55.7,21.02 C10.1 C9.1 | RST.3 RST.4 | C3.2 17.17,56.67 16.18,57.66 v16.18,63.88 | C2.1 C1.1
  Bottom 0.3: v20.74,50.43 20.41,50.76 19.48,50.76 18.93,50.22 v18.93,49.98 | v12.71,54.02 11.62,54.02 10.13,52.53 10.13,48.56 16.03,42.67 16.03,39.79 14.29,38.06 RST.4 | v33.33,49.84 36.01,52.52 36.41,52.52 37.61,53.73 37.61,59.67 C4.2 33.93,67.08 30.58,67.08 30.05,67.61 30.05,68.58 30.99,69.52 C8.2 | v25.48,53.75 26.29,52.93 28.35,52.93 29.06,53.65 v29.06,53.77
  Bottom 0.8: U4.1 U3.1 | C1.1 13.8,63.88 v16.18,63.88
  other vias: 3.95,19.29 12.84,19.29 48.16,1.65 45.16,1.65 42.16,1.65 39.16,1.65 36.16,1.65 33.16,1.65 30.16,1.65 27.16,1.65 24.16,1.65 21.16,1.65 18.16,1.65 15.16,1.65 48.16,3.15 45.16,3.15 42.16,3.15 39.16,3.15 36.16,3.15 33.16,3.15 30.16,3.15 27.16,3.15 24.16,3.15 21.16,3.15 18.16,3.15 15.16,3.15 48.16,4.65 45.16,4.65 42.16,4.65 39.16,4.65 36.16,4.65 33.16,4.65 30.16,4.65 27.16,4.65 24.16,4.65 21.16,4.65 18.16,4.65 15.16,4.65 21.49,36.23 21.49,34.73 21.49,33.23 21.49,31.73 19.99,37.73 19.99,36.23 19.99,34.73 19.99,33.23 19.99,31.73 19.99,30.23 18.49,39.23 18.49,37.73 18.49,36.23 18.49,34.73 16.99,40.73 16.99,39.23 16.99,37.73 16.99,36.23 25.76,52.26 25.76,50.76 24.26,52.26 22.29,56.08 23.79,56.08 38.01,78.41 36.51,78.41 35.01,78.41 33.51,78.41 32.01,78.41 30.51,78.41 29.01,78.41 27.51,78.41 43.8,60.63 43.8,62.13 42.3,62.13 42.3,63.63 40.8,63.63 40.8,65.13 13.09,63.16 31.21,69.52 39.48,61.53
  pour Top (isolate 0.3): -12.03,94.83 78.14,94.83 78.14,-20.75 -12.03,-20.75
  pour Bottom (isolate 0.3): -13.15,96.28 77.02,96.28 77.02,-19.3 -13.15,-19.3
MCLR  (via drill 0.3)
  Top 0.3: U1.30 19.88,50.57 v19.88,50.03
  Top 0.8: RST.1 RST.2 20.1,42.58 v21.45,43.92 21.45,41.24 30.91,31.77 RSTJ.1 | v46.18,13.51 v46.18,16.79
  Bottom 0.3: v19.88,50.03 19.88,45.49 v21.45,43.92
  Bottom 0.8: R1.1 13.38,42.17 RST.2 | SPI.5 49.3,10.19 46.18,13.31 v46.18,13.51 | v46.18,16.79 46.18,30.76 42.5,34.44 33.05,34.44 32.03,33.42 RSTJ.1
  other vias: 32.02,31.77
MISO  (via drill 0.3)
  Top 0.3: U1.22 17.98,60.85 v17.44,60.85 | JP1.10 56.69,35.84 53.26,35.84 50.36,38.74 v36.68,38.74 34.73,38.74 33.88,37.9 33.88,35.69 34.77,34.8 40.11,34.8 48.46,26.44 57.3,26.44 57.89,25.86 57.89,21.26 56.16,19.53 53.49,19.53 50.98,17.02 50.98,5.82 51.69,5.11 SPI.9
  Bottom 0.3: v17.44,60.85 17.01,60.85 14.88,58.72 14.88,46.65 22.79,38.74 v36.68,38.74
MOSI  (via drill 0.3)
  Top 0.3: U1.21 17.88,61.65 v17.44,61.65 | JP1.12 56.69,33.3 54.05,33.3 49.26,38.09 v36.12,38.09
  Bottom 0.3: v17.44,61.65 17,61.65 14.38,59.04 14.38,46.45 22.74,38.09 v36.12,38.09 | JP1.12 56.77,33.38 56.77,26.92 57.86,25.83 57.86,19.13 SPI.1
N$1
  Top 0.8: R2.1 26.23,25.8 28.68,28.25 28.68,30.12 27.5,31.3 RX.A
N$2
  Top 0.8: R4.2 40.16,25.88 37.39,28.65 37.39,30.53 38.15,31.3 TX.A
N$3  (via drill 0.3)
  Bottom 0.8: R6.1 12.09,24.13 5V.A
  other vias: 12.09,25.85
N$6  (via drill 0.3)
  Bottom 0.8: R8.1 9.27,24.11 3.3V.A
  other vias: 9.27,25.85
N$100  (via drill 0.3)
  Top 0.8: C11.2 34.17,31.42 34.52,31.77 RSTJ.2
  other vias: 34.56,31.77
PH0(RXD2)
  Top 0.3: U1.12 19.89,66.01 19.89,75.22 JP4.15
PH1(TXD2)
  Top 0.3: JP4.13 16.89,74.82 16.89,68.3 U1.13
PH2(XCK2)
  Top 0.3: JP4.11 14.78,69.7 U1.14
PH3(OC4A)
  Top 0.3: JP4.9 12.22,75.22 12.22,71.56 U1.15
PH4(OC4B)
  Top 0.3: JP4.7 10.97,73.98 10.97,72.09 U1.16
PH5(OC4C)
  Top 0.3: U1.17 9.96,72.4 9.67,72.69 7.88,72.69 7.16,73.41 JP4.5
PH6(OC2B)
  Top 0.3: U1.18 9.47,72.19 6.77,72.19 4.62,74.33 JP4.3
PH7(T4)
  Top 0.3: JP4.1 2.08,72.81 3.23,71.66 9.28,71.66 15.37,65.58 15.37,54.81 18.03,52.15 19.33,52.15 U1.27
PJ0(RXD3/PCINT9)  (via drill 0.3)
  Top 0.3: U1.63 34.57,50.62 30.61,50.62 v30.48,50.49
  Bottom 0.3: JP4.16 21.64,76.01 21.64,71.53 28.56,64.61 32.05,64.61 34.72,61.95 34.72,53.82 31.39,50.49 v30.48,50.49
PJ1(TXD3/PCINT10)  (via drill 0.3)
  Top 0.3: U1.64 34.75,51.15 v29.86,51.15
  Bottom 0.3: JP4.14 18.57,76.54 18.57,72.95 19,72.51 19.95,72.51 28.35,64.11 31.84,64.11 34.22,61.74 34.22,54.03 31.34,51.15 v29.86,51.15
PJ2(XCK3/PCINT11)  (via drill 0.3)
  Top 0.3: U1.65 34.83,51.77 30.5,51.77 v30.48,51.8
  Bottom 0.3: JP4.12 16.03,76.54 16.03,74.63 18.64,72.01 19.75,72.01 28.15,63.61 31.64,63.61 33.72,61.53 33.72,54.23 31.28,51.8 v30.48,51.8
PJ3(PCINT12)  (via drill 0.3)
  Top 0.3: U1.66 34.86,52.45 v29.86,52.45
  Bottom 0.3: JP4.10 13.54,76.49 13.54,74.61 16.64,71.51 19.54,71.51 27.94,63.11 31.43,63.11 33.22,61.32 33.22,54.44 31.23,52.45 v29.86,52.45
PJ4(PCINT13)  (via drill 0.3)
  Top 0.3: v30.48,53.12 34.89,53.12 U1.67
  Bottom 0.3: JP4.8 10.95,76.54 10.95,74.69 14.63,71.01 19.33,71.01 27.73,62.61 31.22,62.61 32.72,61.12 32.72,54.65 31.19,53.12 v30.48,53.12
PJ5(PCINT14)  (via drill 0.3)
  Top 0.3: v29.88,53.8 34.93,53.8 U1.68
  Bottom 0.3: v29.88,53.8 v29.89,53.8 31.17,53.8 32.22,54.86 32.22,60.91 31.01,62.11 27.52,62.11 19.12,70.51 12.14,70.51 8.43,74.22 8.43,76.52 JP4.6
PJ6(PCINT15)  (via drill 0.3)
  Top 0.3: U1.69 34.97,54.46 v30.43,54.46
  Bottom 0.3: JP4.4 5.92,76.49 5.92,72.32 8.23,70.01 18.92,70.01 27.32,61.61 30.71,61.61 31.72,60.61 31.72,55.06 31.11,54.46 v30.43,54.46
PJ7  (via drill 0.3)
  Top 0.3: U1.79 36.46,55.13 v29.82,55.13
  Bottom 0.3: v29.82,55.13 31.08,55.13 31.22,55.27 31.22,60.4 30.5,61.11 27.11,61.11 18.71,69.51 7.98,69.51 3.33,74.17 3.33,76.54 JP4.2
PK0(ADC8/PCINT16)  (via drill 0.3)
  Top 0.3: U1.89 34.61,60.35 v29.86,60.35
  Bottom 0.3: v29.86,60.35 27.16,60.35 18.5,69.01 5.92,69.01 JP5.15
PK1(ADC9/PCINT17)  (via drill 0.3)
  Top 0.3: U1.88 34.66,59.7 v30.48,59.7
  Bottom 0.3: v30.48,59.7 26.88,59.7 18.08,68.5 5.36,68.5 JP5.13
PK2(ADC10/PCINT18)  (via drill 0.3)
  Top 0.3: U1.87 34.72,59.05 v29.86,59.05
  Bottom 0.3: v29.86,59.05 26.73,59.05 17.77,68 7.37,68 4.62,65.25 JP5.11
PK3(ADC11/PCINT19)  (via drill 0.3)
  Top 0.3: U1.86 34.77,58.39 v30.48,58.39
  Bottom 0.3: v30.48,58.39 26.55,58.39 17.44,67.5 9.1,67.5 4.62,63.02 JP5.9
PK4(ADC12/PCINT20)  (via drill 0.3)
  Top 0.3: U1.85 34.83,57.74 v29.86,57.74
  Bottom 0.3: v29.86,57.74 26.4,57.74 17.14,67 9.31,67 7.3,65 7.3,62.83 JP5.7
PK5(ADC13/PCINT21)  (via drill 0.3)
  Top 0.3: U1.84 34.88,57.09 v30.48,57.09
  Bottom 0.3: v30.48,57.09 26.25,57.09 16.83,66.5 9.79,66.5 7.8,64.52 7.8,60.79 JP5.5
PK6(ADC14/PCINT22)  (via drill 0.3)
  Top 0.3: U1.83 34.94,56.44 v29.86,56.44
  Bottom 0.3: JP5.3 8.3,58.75 8.3,64.31 10,66 16.53,66 26.09,56.44 v29.86,56.44
PK7(ADC15/PCINT23)  (via drill 0.3)
  Top 0.3: 30.61,55.78 v30.48,55.78 34.99,55.78 U1.82 | U1.82 38,58.79 U1.82
  Bottom 0.3: v30.48,55.78 25.84,55.78 16.12,65.5 10.25,65.5 8.8,64.06 8.8,56.71 JP5.1
PL0(ICP4)
  Top 0.3: JP5.16 3.3,69.09 6.76,69.09 8.85,66.99 8.85,49.34 9.91,48.28 21.12,48.28 U1.35
PL1(ICP5)
  Top 0.3: U1.36 21.33,47.78 9.7,47.78 8.35,49.13 8.35,64.4 6.22,66.52 3.33,66.52 JP5.14
PL2(T5)
  Top 0.3: JP5.12 3.33,63.98 6.02,63.98 7.85,62.15 7.85,48.92 9.49,47.28 21.54,47.28 U1.37
PL3(OC5A)
  Top 0.3: U1.38 21.75,46.78 9.28,46.78 7.35,48.71 7.35,59.86 5.79,61.42 3.35,61.42 JP5.10
PL4(OC5B)
  Top 0.3: JP5.8 3.35,58.88 5.61,58.88 6.85,57.64 6.85,48.5 9.07,46.28 21.95,46.28 U1.39
PL5(OC5C)
  Top 0.3: U1.40 22.16,45.78 8.87,45.78 6.35,48.3 6.35,55.22 5.26,56.31 3.38,56.31 JP5.6
PL6
  Top 0.3: U1.41 22.37,45.28 5.49,45.28 3.38,47.39 3.38,53.77 JP5.4
PL7
  Top 0.3: U1.42 22.57,44.78 5.28,44.78 2.08,47.98 JP5.2
RX  (via drill 0.3)
  Top 0.508: U2.3 v31.39,21.38 v31.39,21.39
  Bottom 0.508: v31.39,21.39 31.39,21.92 33.55,24.08 R3.2
RX0  (via drill 0.3)
  Top 0.8: RX.C 24.35,29.2 22.68,27.52 TXJ.1
  Bottom 0.8: R5.2 26.1,21.41 TXJ.1
  other vias: 22.68,21.41
RXC  (via drill 0.3)
  Top 0.3: JP3.15 57.87,75.25 53.52,70.89 28.07,70.89 26.82,69.65 26.82,66.14 U1.2 29.13,63.84 29.13,62.84 27.58,61.29 27.58,49.97 28.59,48.95 28.59,48.09 v28.28,47.77 | v28.66,35.34 28.49,35.51 28.46,35.51 22.38,41.6 v22.38,42.95
  Bottom 0.3: v28.28,47.77 23.45,42.95 v22.38,42.95 | v28.66,35.34 25.76,35.34 22.68,32.25 TXJ.2
SCK  (via drill 0.3)
  Top 0.3: U1.20 17.78,62.46 v17.44,62.46 | JP1.14 56.77,30.84 54.13,30.84 47.57,37.39 v36.68,37.39 36.41,37.39 36.36,37.44 35.02,37.44 34.38,36.8 34.38,35.89 34.98,35.3 40.31,35.3 48.67,26.94 57.51,26.94 58.39,26.06 58.39,21.05 56.34,19.01 53.7,19.01 51.48,16.79 51.48,8.41 52.24,7.64 SPI.7
  Bottom 0.3: v17.44,62.46 17.1,62.46 13.88,59.24 13.88,46.24 22.68,37.44 36.6,37.44 36.65,37.39 v36.68,37.39
TX  (via drill 0.3)
  Top 0.508: U2.2 30.12,21.27 v30.1,21.29
  Bottom 0.508: v30.1,21.29 27.3,24.08 R5.1
TX0  (via drill 0.3)
  Top 0.8: TX.C 41.74,29.2 43.37,27.57 v43.37,21.28
  Bottom 0.8: v43.37,21.28 R3.1 43.22,21.28 RXJ.1
TXC  (via drill 0.3)
  Top 0.3: JP3.13 51.59,71.39 27.86,71.39 26.31,69.85 26.31,65.94 U1.3 28.63,63.63 28.63,63.04 27.08,61.49 27.08,49.1 v27.74,48.44 | v23.06,43.71 23.06,41.62 28.67,36.01 v29.84,36.01
  Bottom 0.3: v27.74,48.44 23.06,43.76 v23.06,43.71 | v29.84,36.01 30.4,35.45 30.4,27.51 32,25.91 41.59,25.91 43.35,24.14 RXJ.2
V3
  Top 0.6: U2.4 32.66,18.79 C7.1
VIN
  Top 0.8: U3.3 17.42,17.15 J2.3
XI  (via drill 0.3)
  Top 0.6: U2.7 36.47,18.09 37.34,17.22 v38.41,17.22 | v41.2,17.25 44.29,17.25 Y2.2
  Top 0.8: C10.2 49.36,22.32 Y2.2
  Bottom 0.6: v38.41,17.22 41.17,17.22 v41.2,17.25
XO  (via drill 0.3)
  Top 0.6: U2.8 37.74,18.95 v38.41,18.29 | v41.22,18.29 43.28,18.29 47.82,22.83 Y2.1
  Top 0.8: Y2.1 48.46,24.98 C9.2
  Bottom 0.6: v38.41,18.29 v41.22,18.29
XTAL1
  Top 0.3: U1.34 20.92,48.78 14.98,48.78 Y1.2 | 10.41,56.57 10.41,56.34
  Top 0.8: C2.2 10.41,60.52 10.41,56.57 | 10.41,56.34 10.41,53.34 Y1.2
XTAL2
  Top 0.3: U1.33 20.71,49.28 16.48,49.28 11.95,53.82 Y1.1
  Top 0.8: Y1.1 13.09,57.78 C1.2

### Text on the board
tNames: PG0 | PF7 / PE7 | PJ0 / PH0 | PC7 / PD7 | PL7 | PK7 | PA7 / PB7